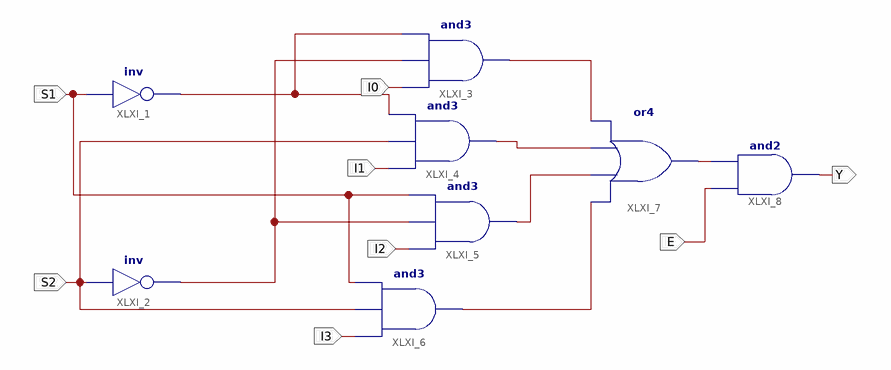
[diagram p0: schematic sheet 1]
// Xilinx ISE schematic MUX4_1.sch (artix7) as structural Verilog: 8 symbols, 8 ports
module MUX4_1 (
  input  S2,
  input  S1,
  input  I0,
  input  I1,
  input  I2,
  input  I3,
  input  E,
  output Y
);

  wire XLXN_2, XLXN_12, XLXN_24, XLXN_27, XLXN_29, XLXN_30, XLXN_32;

  not XLXI_1 (XLXN_12, S1);
  not XLXI_2 (XLXN_2, S2);
  and XLXI_3 (XLXN_24, I0, XLXN_2, XLXN_12);
  and XLXI_4 (XLXN_29, I1, S2, XLXN_12);
  and XLXI_5 (XLXN_30, I2, XLXN_2, S1);
  and XLXI_6 (XLXN_27, I3, S2, S1);
  or XLXI_7 (XLXN_32, XLXN_27, XLXN_30, XLXN_29, XLXN_24);
  and XLXI_8 (Y, E, XLXN_32);
endmodule
